# Altium schematic sheet 04-摇杆模块--原理图.SchDoc
size A4
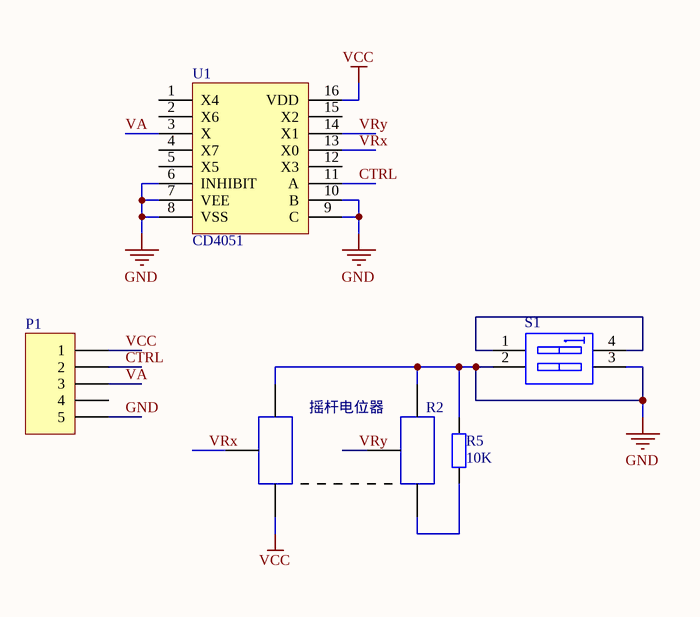
[diagram p0: 04-摇杆模块--原理图.SchDoc]

## Parts
P1  Header 5  [USB/SM0.8-6H5]  (value not drawn)
R2  摇杆电位器  [摇杆电位器]
R5  value 10K  [0805]  (hidden comment: Res2)
S1  SW DIP-2  [Button]  (value not drawn)
U1  CD4051  [SUPER16]

## Nets
GND: P1.5 R2.1 R2.4 R5.2 S1.2(A2) S1.3(B2) U1.6(INHIBIT) U1.7(VEE) U1.8(VSS) U1.9(C) U1.10(B)
VCC: P1.1 R2.3 U1.16(VDD)
CTRL: P1.2 U1.11(A)
VA: P1.3 U1.3(X)
VRx: R2.2 U1.13(X0)
VRy: R2.5 U1.14(X1)
NetR2_6: R2.6 R5.1
NetS1_1: S1.1(A1) S1.4(B1)

Not connected (* = marked no-connect by the designer): P1 4; R2 0; U1 1(X4) 2(X6) 4(X7) 5(X5) 12(X3) 15(X2)

## Library data of the parts
P1 = Header 5: Header, 5-Pin; LatestRevisionDate: 17-Jul-2002; LatestRevisionNote: Re-released for DXP Platform.; Publisher: Altium Limited
R2 = 电位器
R5 = Res2: Resistor; Published: 8-Jun-2000; LatestRevisionDate: 17-Jul-2002; LatestRevisionNote: Re-released for DXP Platform.; PackageReference: AXIAL-0.4; Publisher: Altium Limited
S1 = SW DIP-2: DIP Switch, 2 Position, SPST; Published: 24-Mar-1999; LatestRevisionDate: 17-Jul-2002; LatestRevisionNote: Re-released for DXP Platform.; PackageReference: DIP-4; Publisher: Altium Limited